# Altium schematic sheet RCU.SchDoc
size A4
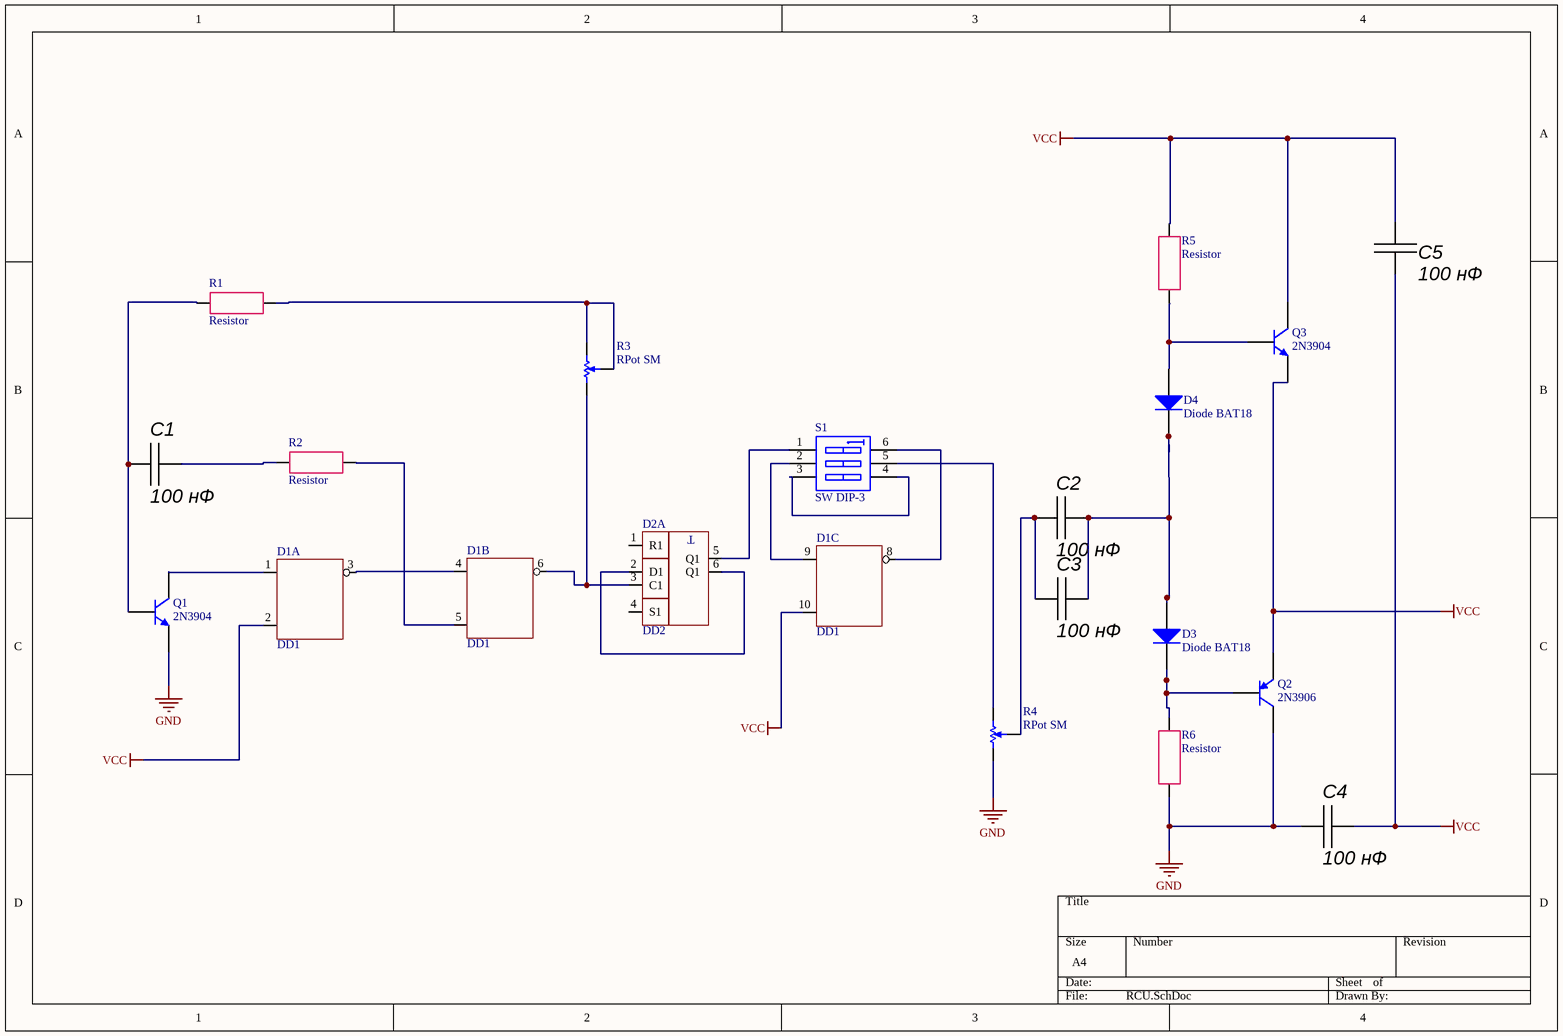
[diagram p0: RCU.SchDoc]

## Parts
C1  100 нФ  [C_0805]
C2  100 нФ  [C_0805]
C3  100 нФ  [C_0805]
C4  100 нФ  [C_0805]
C5  100 нФ  [C_0805]
D1  DD1  [TSOP127P600X152-14N]  (parts A,B,C of 4)
D2  DD2  [TSOP127P600X152-14N]  (part A of 2)
D3  Diode BAT18  [SOT-23_N]
D4  Diode BAT18  [SOT-23_N]
Q1  2N3904  [TO-92A]
Q2  2N3906  [TO-92A]
Q3  2N3904  [TO-92A]
R1  Resistor  [Res]
R2  Resistor  [Res]
R3  RPot SM  [POT4MM-2]
R4  RPot SM  [POT4MM-2]
R5  Resistor  [Res]
R6  Resistor  [Res]
S1  SW DIP-3  [DIP-6]

## Nets
GND: C4.2 D1.7 D1.15 D2.7 Q1.1(E) Q2.3(C) R4.CCW(-) R6.1
VCC: C4.1 C5.1 C5.2 D1.2 D1.10 D1.14 D2.14 Q2.1(E) Q3.1(E) Q3.3(C) R5.2
NetC1_1: C1.1 Q1.2(B) R1.1
NetC1_2: C1.2 R2.1
NetC2_1: C2.1 C3.1 R4.W
NetC2_2: C2.2 C3.2 D3.1(A) D4.3(K)
NetD1_1: D1.1 Q1.3(C)
NetD1_3: D1.3 D1.4
NetD1_5: D1.5 R2.2
NetD1_6: D1.6 D2.3(C1) R3.CCW(-)
NetD1_8: D1.8 S1.6(B1)
NetD1_9: D1.9 S1.2(A2)
NetD2_2: D2.2(D1) D2.6(Q1)
NetD2_5: D2.5(Q1) S1.1(A1)
NetD3_3: D3.3(K) Q2.2(B) R6.2
NetR1_2: R1.2 R3.CW(+) R3.W
NetR4_CW: R4.CW(+) S1.5(B2)
NetS1_3: S1.3(A3) S1.4(B3)

Not connected (* = marked no-connect by the designer): D2 1(R1) 4(S1); D4 1(A); Q3 2(B); R5 1

## Notes on the sheet
- (in symbol DD2, part A) T

## Library data of the parts
C1-C5 = Capacitor: 100n; Type: Конденсатор ЧИП; Name: 0805; Power/Voltage: 50В; Tolerance: 10%; Value: 100 нФ
D3 D4 = Diode BAT18: Low-Loss RF Switching Diode; Note: Pin 2 is not connected and not drawn.; Published: 21-Mar-2003; LatestRevisionDate: 29-May-2009; LatestRevisionNote: IPC-7351 Footprint Added.; DatasheetVersion: Oct-1999; PackageVersion: Sep-2001; PackageReference: SOT-23; Publisher: Altium Limited; PackageDescription: 3-Pin SOT-23 Package 0.95 mm Pitch, 2.5 mm Lead Span; ComponentLink1Description: Manufacturer Link; ComponentLink1URL: http://www.infineon.com/
Q1 Q3 = 2N3904: NPN General Purpose Amplifier; Published: 8-Jun-2000; LatestRevisionDate: 15-Jan-2003; LatestRevisionNote: PCB Footprint 'BCY-W3/D4.7' replaced; DatasheetVersion: 1997; PackageVersion: Sep-1998; PackageReference: TO-92A; Publisher: Altium Limited; PackageDescription: TO, Flat Index; 3 In-Line, Axial Leads; Body Dia. 4.5mm; Leads 0.51 x 0.48 mm (max); ComponentLink1Description: Manufacturer Link; ComponentLink1URL: http://www.fairchildsemi.com/; ComponentLink2Description: Datasheet; ComponentLink2URL: http://www.fairchildsemi.com/ds/2N%2F2N3904.pdf
Q2 = 2N3906: PNP General Purpose Amplifier; Published: 8-Jun-2000; LatestRevisionDate: 15-Jan-2003; LatestRevisionNote: PCB Footprint 'BCY-W3/D4.7' replaced; DatasheetVersion: 1997; PackageVersion: Sep-1998; PackageReference: TO-92A; Publisher: Altium Limited; PackageDescription: TO, Flat Index; 3 In-Line, Axial Leads; Body Dia. 4.5mm; Leads 0.51 x 0.48 mm (max); ComponentLink1Description: Manufacturer Link; ComponentLink1URL: http://www.fairchildsemi.com/; ComponentLink2Description: Datasheet; ComponentLink2URL: http://www.fairchildsemi.com/ds/2N%2F2N3906.pdf
R3 R4 = RPot SM: Square Trimming Potentiometer; Published: 17-Dec-2003; DatasheetVersion: Oct-2003; PackageReference: POT4MM-2; Publisher: Altium Limited; PackageDescription: Square Trimming Potentiometer; ComponentLink1Description: Manufacturer Link; ComponentLink1URL: http://bourns.com/2/search.html
S1 = SW DIP-3: DIP Switch, 3 Position, SPST; Published: 24-Mar-1999; LatestRevisionDate: 17-Jul-2002; LatestRevisionNote: Re-released for DXP Platform.; PackageReference: DIP-6; Publisher: Altium Limited; Code_JEDEC: MO-001-AM